# EAGLE design untitled (EAGLE 9.6.2)
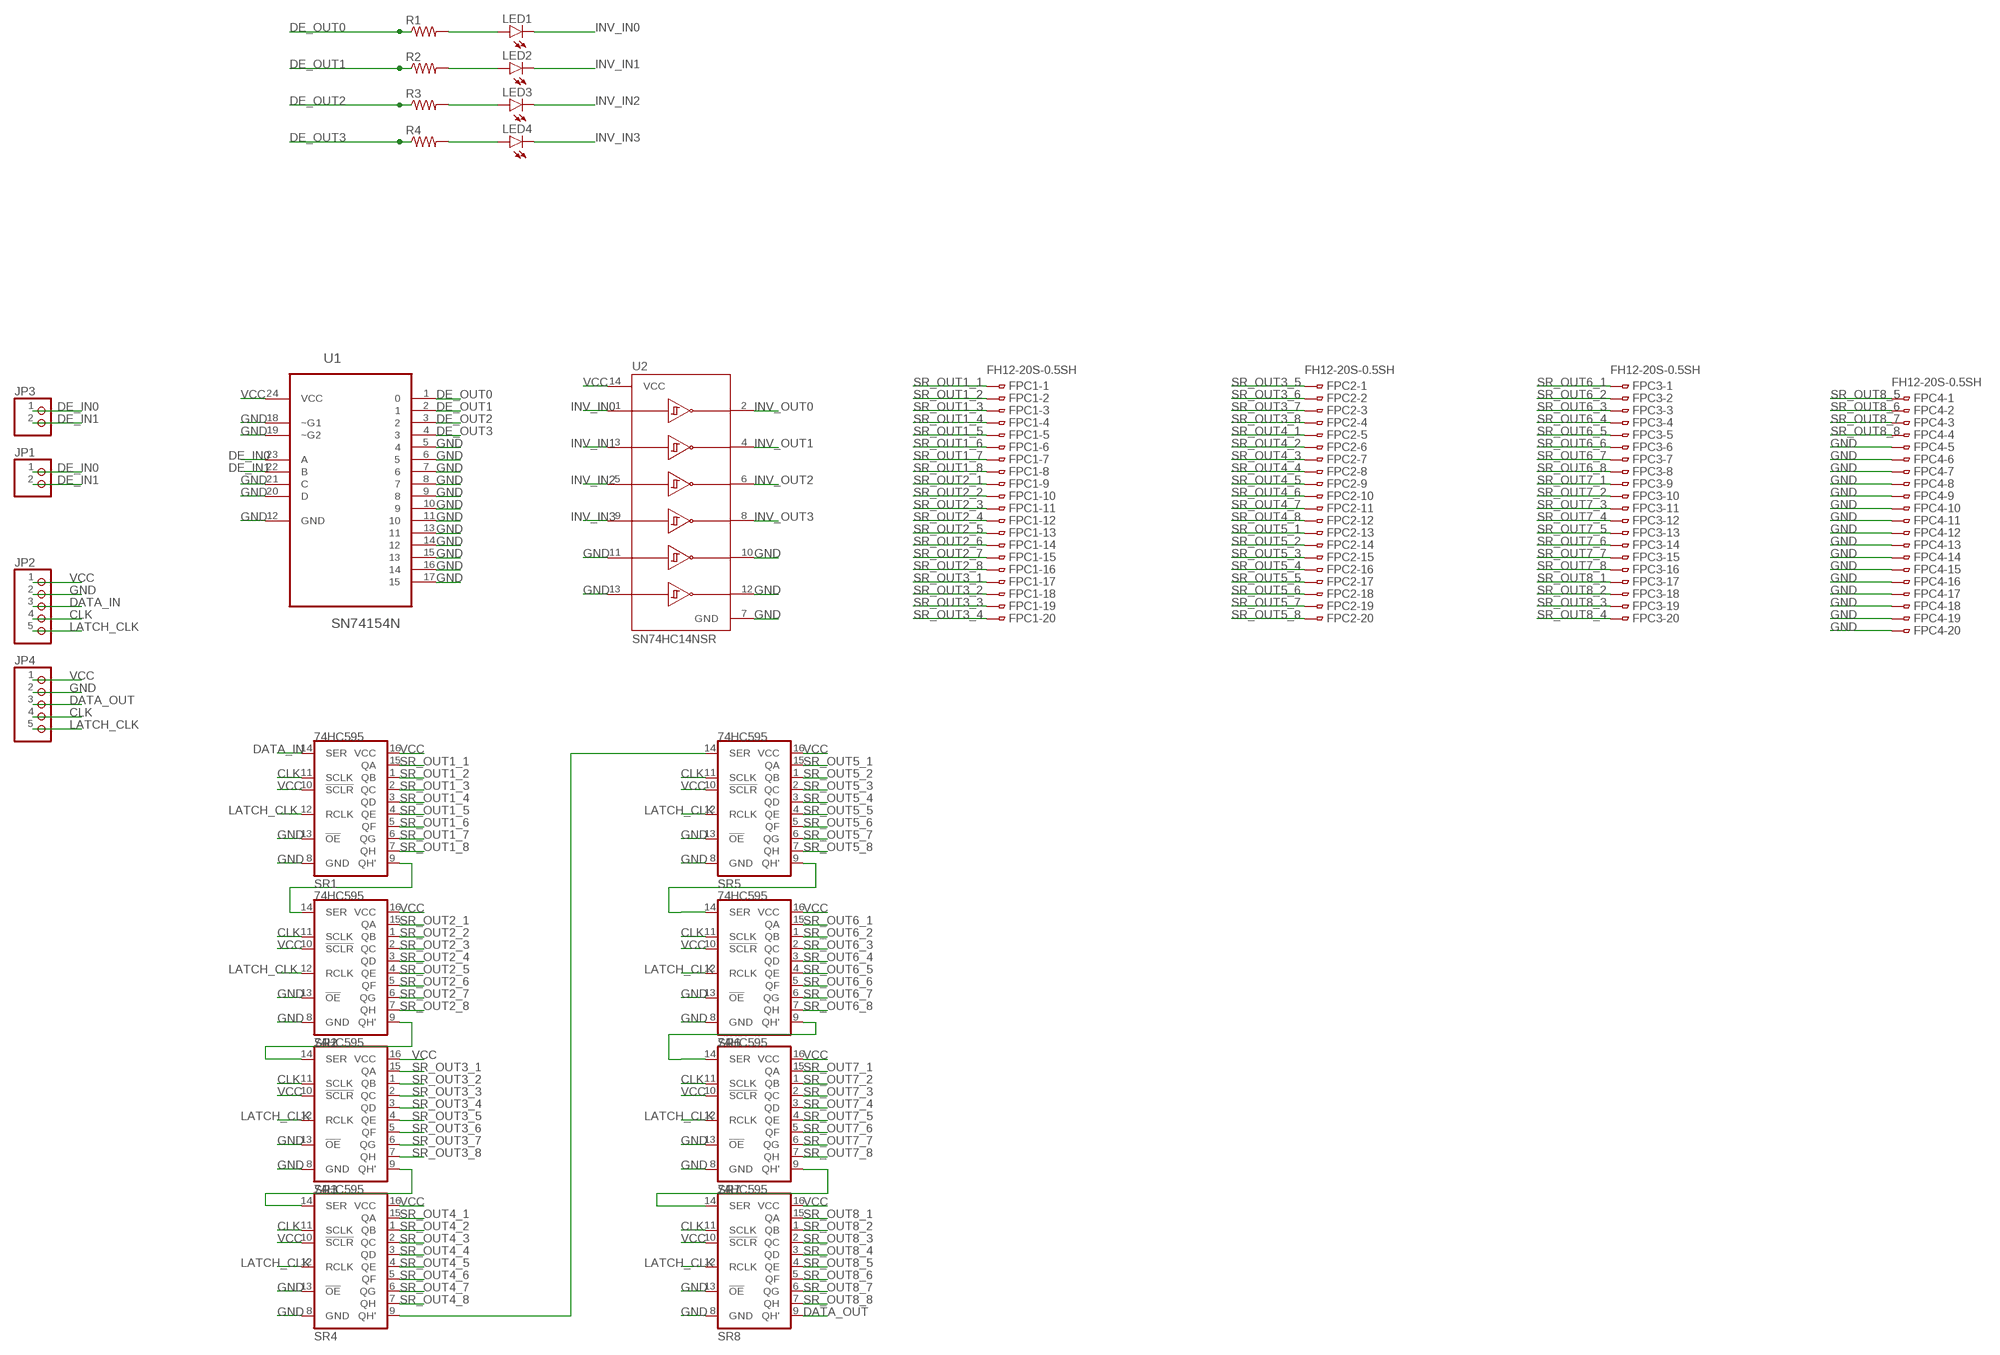
[diagram p0: schematic, sheet 1]

## Parts
FPC1  FH12-20S-0.5SH  [FH12-20S-0.5SH]
FPC2  FH12-20S-0.5SH  [FH12-20S-0.5SH]
FPC3  FH12-20S-0.5SH  [FH12-20S-0.5SH]
FPC4  FH12-20S-0.5SH  [FH12-20S-0.5SH]
JP1  PINHD-1X2  [1X02]
JP2  PINHD-1X5  [1X05]
JP3  PINHD-1X2  [1X02]
JP4  PINHD-1X5  [1X05]
LED1  LEDCHIPLED_0805  [CHIPLED_0805]
LED2  LEDCHIPLED_0805  [CHIPLED_0805]
LED3  LEDCHIPLED_0805  [CHIPLED_0805]
LED4  LEDCHIPLED_0805  [CHIPLED_0805]
R1  R-US_R0805  [R0805]
R2  R-US_R0805  [R0805]
R3  R-US_R0805  [R0805]
R4  R-US_R0805  [R0805]
SR1  74HC595  [SO16]
SR2  74HC595  [SO16]
SR3  74HC595  [SO16]
SR4  74HC595  [SO16]
SR5  74HC595  [SO16]
SR6  74HC595  [SO16]
SR7  74HC595  [SO16]
SR8  74HC595  [SO16]
U1  SN74154N  [DIP254P1080X508-24]
U2  SN74HC14NSR  [SOP127P780X200-14N]

## Nets
CLK: JP2.4 JP4.4 SR1.11(SCLK) SR2.11(SCLK) SR3.11(SCLK) SR4.11(SCLK) SR5.11(SCLK) SR6.11(SCLK) SR7.11(SCLK) SR8.11(SCLK)
DATA_IN: JP2.3 SR1.14(SER)
DATA_OUT: JP4.3 SR8.9(QH')
DE_IN0: JP1.1 JP3.1 U1.23(A)
DE_IN1: JP1.2 JP3.2 U1.22(B)
DE_OUT0: R1.1 U1.1
DE_OUT1: R2.1 U1.2
DE_OUT2: R3.1 U1.3
DE_OUT3: R4.1 U1.4
GND: FPC4.5 FPC4.6 FPC4.7 FPC4.8 FPC4.9 FPC4.10 FPC4.11 FPC4.12 FPC4.13 FPC4.14 FPC4.15 FPC4.16 FPC4.17 FPC4.18 FPC4.19 FPC4.20 JP2.2 JP4.2 SR1.8(GND) SR1.13(!OE) SR2.8(GND) SR2.13(!OE) SR3.8(GND) SR3.13(!OE) SR4.8(GND) SR4.13(!OE) SR5.8(GND) SR5.13(!OE) SR6.8(GND) SR6.13(!OE) SR7.8(GND) SR7.13(!OE) SR8.8(GND) SR8.13(!OE) U1.5 U1.6 U1.7 U1.8 U1.9 U1.10 U1.11 U1.12(GND) U1.13 U1.14 U1.15 U1.16 U1.17 U1.18(~G1) U1.19(~G2) U1.20(D) U1.21(C) U2.7(GND) U2.10(5Y) U2.11(5A) U2.12(6Y) U2.13(6A)
INV_IN0: LED1.C U2.1(1A)
INV_IN1: LED2.C U2.3(2A)
INV_IN2: LED3.C U2.5(3A)
INV_IN3: LED4.C U2.9(4A)
INV_OUT0: U2.2(1Y)
INV_OUT1: U2.4(2Y)
INV_OUT2: U2.6(3Y)
INV_OUT3: U2.8(4Y)
LATCH_CLK: JP2.5 JP4.5 SR1.12(RCLK) SR2.12(RCLK) SR3.12(RCLK) SR4.12(RCLK) SR5.12(RCLK) SR6.12(RCLK) SR7.12(RCLK) SR8.12(RCLK)
N$1: SR1.9(QH') SR2.14(SER)
N$2: LED1.A R1.2
N$3: LED2.A R2.2
N$4: LED3.A R3.2
N$5: LED4.A R4.2
N$8: SR2.9(QH') SR3.14(SER)
N$15: SR3.9(QH') SR4.14(SER)
N$22: SR7.9(QH') SR8.14(SER)
N$34: SR6.9(QH') SR7.14(SER)
N$36: SR4.9(QH') SR5.14(SER)
N$43: SR5.9(QH') SR6.14(SER)
SR_OUT1_1: FPC1.1 SR1.15(QA)
SR_OUT1_2: FPC1.2 SR1.1(QB)
SR_OUT1_3: FPC1.3 SR1.2(QC)
SR_OUT1_4: FPC1.4 SR1.3(QD)
SR_OUT1_5: FPC1.5 SR1.4(QE)
SR_OUT1_6: FPC1.6 SR1.5(QF)
SR_OUT1_7: FPC1.7 SR1.6(QG)
SR_OUT1_8: FPC1.8 SR1.7(QH)
SR_OUT2_1: FPC1.9 SR2.15(QA)
SR_OUT2_2: FPC1.10 SR2.1(QB)
SR_OUT2_3: FPC1.11 SR2.2(QC)
SR_OUT2_4: FPC1.12 SR2.3(QD)
SR_OUT2_5: FPC1.13 SR2.4(QE)
SR_OUT2_6: FPC1.14 SR2.5(QF)
SR_OUT2_7: FPC1.15 SR2.6(QG)
SR_OUT2_8: FPC1.16 SR2.7(QH)
SR_OUT3_1: FPC1.17 SR3.15(QA)
SR_OUT3_2: FPC1.18 SR3.1(QB)
SR_OUT3_3: FPC1.19 SR3.2(QC)
SR_OUT3_4: FPC1.20 SR3.3(QD)
SR_OUT3_5: FPC2.1 SR3.4(QE)
SR_OUT3_6: FPC2.2 SR3.5(QF)
SR_OUT3_7: FPC2.3 SR3.6(QG)
SR_OUT3_8: FPC2.4 SR3.7(QH)
SR_OUT4_1: FPC2.5 SR4.15(QA)
SR_OUT4_2: FPC2.6 SR4.1(QB)
SR_OUT4_3: FPC2.7 SR4.2(QC)
SR_OUT4_4: FPC2.8 SR4.3(QD)
SR_OUT4_5: FPC2.9 SR4.4(QE)
SR_OUT4_6: FPC2.10 SR4.5(QF)
SR_OUT4_7: FPC2.11 SR4.6(QG)
SR_OUT4_8: FPC2.12 SR4.7(QH)
SR_OUT5_1: FPC2.13 SR5.15(QA)
SR_OUT5_2: FPC2.14 SR5.1(QB)
SR_OUT5_3: FPC2.15 SR5.2(QC)
SR_OUT5_4: FPC2.16 SR5.3(QD)
SR_OUT5_5: FPC2.17 SR5.4(QE)
SR_OUT5_6: FPC2.18 SR5.5(QF)
SR_OUT5_7: FPC2.19 SR5.6(QG)
SR_OUT5_8: FPC2.20 SR5.7(QH)
SR_OUT6_1: FPC3.1 SR6.15(QA)
SR_OUT6_2: FPC3.2 SR6.1(QB)
SR_OUT6_3: FPC3.3 SR6.2(QC)
SR_OUT6_4: FPC3.4 SR6.3(QD)
SR_OUT6_5: FPC3.5 SR6.4(QE)
SR_OUT6_6: FPC3.6 SR6.5(QF)
SR_OUT6_7: FPC3.7 SR6.6(QG)
SR_OUT6_8: FPC3.8 SR6.7(QH)
SR_OUT7_1: FPC3.9 SR7.15(QA)
SR_OUT7_2: FPC3.10 SR7.1(QB)
SR_OUT7_3: FPC3.11 SR7.2(QC)
SR_OUT7_4: FPC3.12 SR7.3(QD)
SR_OUT7_5: FPC3.13 SR7.4(QE)
SR_OUT7_6: FPC3.14 SR7.5(QF)
SR_OUT7_7: FPC3.15 SR7.6(QG)
SR_OUT7_8: FPC3.16 SR7.7(QH)
SR_OUT8_1: FPC3.17 SR8.15(QA)
SR_OUT8_2: FPC3.18 SR8.1(QB)
SR_OUT8_3: FPC3.19 SR8.2(QC)
SR_OUT8_4: FPC3.20 SR8.3(QD)
SR_OUT8_5: FPC4.1 SR8.4(QE)
SR_OUT8_6: FPC4.2 SR8.5(QF)
SR_OUT8_7: FPC4.3 SR8.6(QG)
SR_OUT8_8: FPC4.4 SR8.7(QH)
VCC: JP2.1 JP4.1 SR1.10(!SCLR) SR1.16(VCC) SR2.10(!SCLR) SR2.16(VCC) SR3.10(!SCLR) SR3.16(VCC) SR4.10(!SCLR) SR4.16(VCC) SR5.10(!SCLR) SR5.16(VCC) SR6.10(!SCLR) SR6.16(VCC) SR7.10(!SCLR) SR7.16(VCC) SR8.10(!SCLR) SR8.16(VCC) U1.24(VCC) U2.14(VCC)

## Library data of the parts
FPC1-FPC4 = con-hirose:FH12-20S-0.5S: 0.5mm Pitch Connectors For FPC/FFC Source: Data sheet <http://www.hirose.co.jp/cataloge_hp/e58605370.pdf>; MPN: FH12-20S-0.5SH(55); OC_FARNELL: 1324549; OC_NEWARK: 34M6166
JP1 JP3 = pinhead:PINHD-1X2: PIN HEADER
JP2 JP4 = pinhead:PINHD-1X5: PIN HEADER
LED1-LED4 = led:LED: LED OSRAM: - CHIPLED LG R971, LG N971, LY N971, LG Q971, LY Q971, LO R971, LY R971 LH N974, LH R974 LS Q976, LO Q976, LY Q976 LO Q996 - Hyper CHIPLED LW Q18S LB Q993, LB Q99A, LB R99A - SideLED LS A670, LO A670, LY A670, LG A670, LP A670 LB A673, LV A673, LT A673, LW A673 LH A674 LY A675 LS A676, LA A676, LO A676, LY A676, LW A676 LS A679, LY A679, LG A679 - Hyper Micro SIDELED® LS Y876, LA Y876, LO Y876, LY Y876 LT Y87S - SmartLED LW L88C, LW L88S LB L89C, LB L89S, LG L890 LS L89K, LO L89K, LY L89K LS L896, LA L896, LO L896, LY L896 - TOPLED LS T670, LO T670, LY T670, LG T670, LP T670 LSG T670, LSP T670, LSY T670, LOP T670, LYG T670 LG T671, LOG T671, LSG T671 LB T673, LV T673, LT T673, LW T673 LH T674 LS T676, LA T676, LO T676, LY T676, LB T676, LH T676, LSB T676, LW T676 LB T67C, LV T67C, LT T67C, LS T67K, LO T67K, LY T67K, LW E67C LS E67B, LA E67B, LO E67B, LY E67B, LB E67C, LV E67C, LT E67C LW T67C LS T679, LY T679, LG T679 LS T770, LO T770, LY T770, LG T770, LP T770 LB T773, LV T773, LT T773, LW T773 LH T774 LS E675, LA E675, LY E675, LS T675 LS T776, LA T776, LO T776, LY T776, LB T776 LHGB T686 LT T68C, LB T68C - Hyper Mini TOPLED® LB M676 - Mini TOPLED Santana® LG M470 LS M47K, LO M47K, LY M47K Source: http://www.osram.convergy.de LUXEON: - LUMILED® LXK2-PW12-R00, LXK2-PW12-S00, LXK2-PW14-U00, LXK2-PW14-V00 LXK2-PM12-R00, LXK2-PM12-S00, LXK2-PM14-U00 LXK2-PE12-Q00, LXK2-PE12-R00, LXK2-PE12-S00, LXK2-PE14-T00, LXK2-PE14-U00 LXK2-PB12-K00, LXK2-PB12-L00, LXK2-PB12-M00, LXK2-PB14-N00, LXK2-PB14-P00, LXK2-PB14-Q00 LXK2-PR12-L00, LXK2-PR12-M00, LXK2-PR14-Q00, LXK2-PR14-R00 LXK2-PD12-Q00, LXK2-PD12-R00, LXK2-PD12-S00 LXK2-PH12-R00, LXK2-PH12-S00 LXK2-PL12-P00, LXK2-PL12-Q00, LXK2-PL12-R00 Source: www.luxeon.com KINGBRIGHT: KA-3528ASYC Source: www.kingbright.com
R1-R4 = rcl:R-US_: RESISTOR, American symbol; SPICEPREFIX: R
SR1-SR8 = 74HC595:74HC595: 8-bit SHIFT REGISTER, output latch Check availability <https://pricing.snapeda.com/parts/74HC595/Nexperia/view-part?ref=eda>; AVAILABILITY: In Stock; DESCRIPTION: Shift Register Single 8-Bit Serial to Serial/Parallel 16-Pin SSOP T/R; MF: Nexperia; MP: 74HC595; PACKAGE: None; PRICE: None
U1 = SN74154N:SN74154N: DECODERS/DEMULTIPLEXERS Check availability <https://pricing.snapeda.com/parts/SN74154N/Texas%20Instruments/view-part?ref=eda>; AVAILABILITY: In Stock; DESCRIPTION: Decoder/Demultiplexer 1 x 4:16 24-PDIP; MF: Texas Instruments; MP: SN74154N; PACKAGE: DIP-24 Texas Instruments; PRICE: None; PURCHASE-URL: https://pricing.snapeda.com/search?q=SN74154N&ref=eda
U2 = SN74HC14NSR:SN74HC14NSR: Check availability <https://pricing.snapeda.com/parts/SN74HC14NSR/Texas%20Instruments/view-part?ref=eda>; AVAILABILITY: In Stock; DESCRIPTION: 6-ch, 2-V to 6-V inverters with Schmitt-Trigger inputs; MF: Texas Instruments; MP: SN74HC14NSR; PACKAGE: SOP-14 Texas Instruments; PRICE: None; PURCHASE-URL: https://pricing.snapeda.com/search?q=SN74HC14NSR&ref=eda

## Board
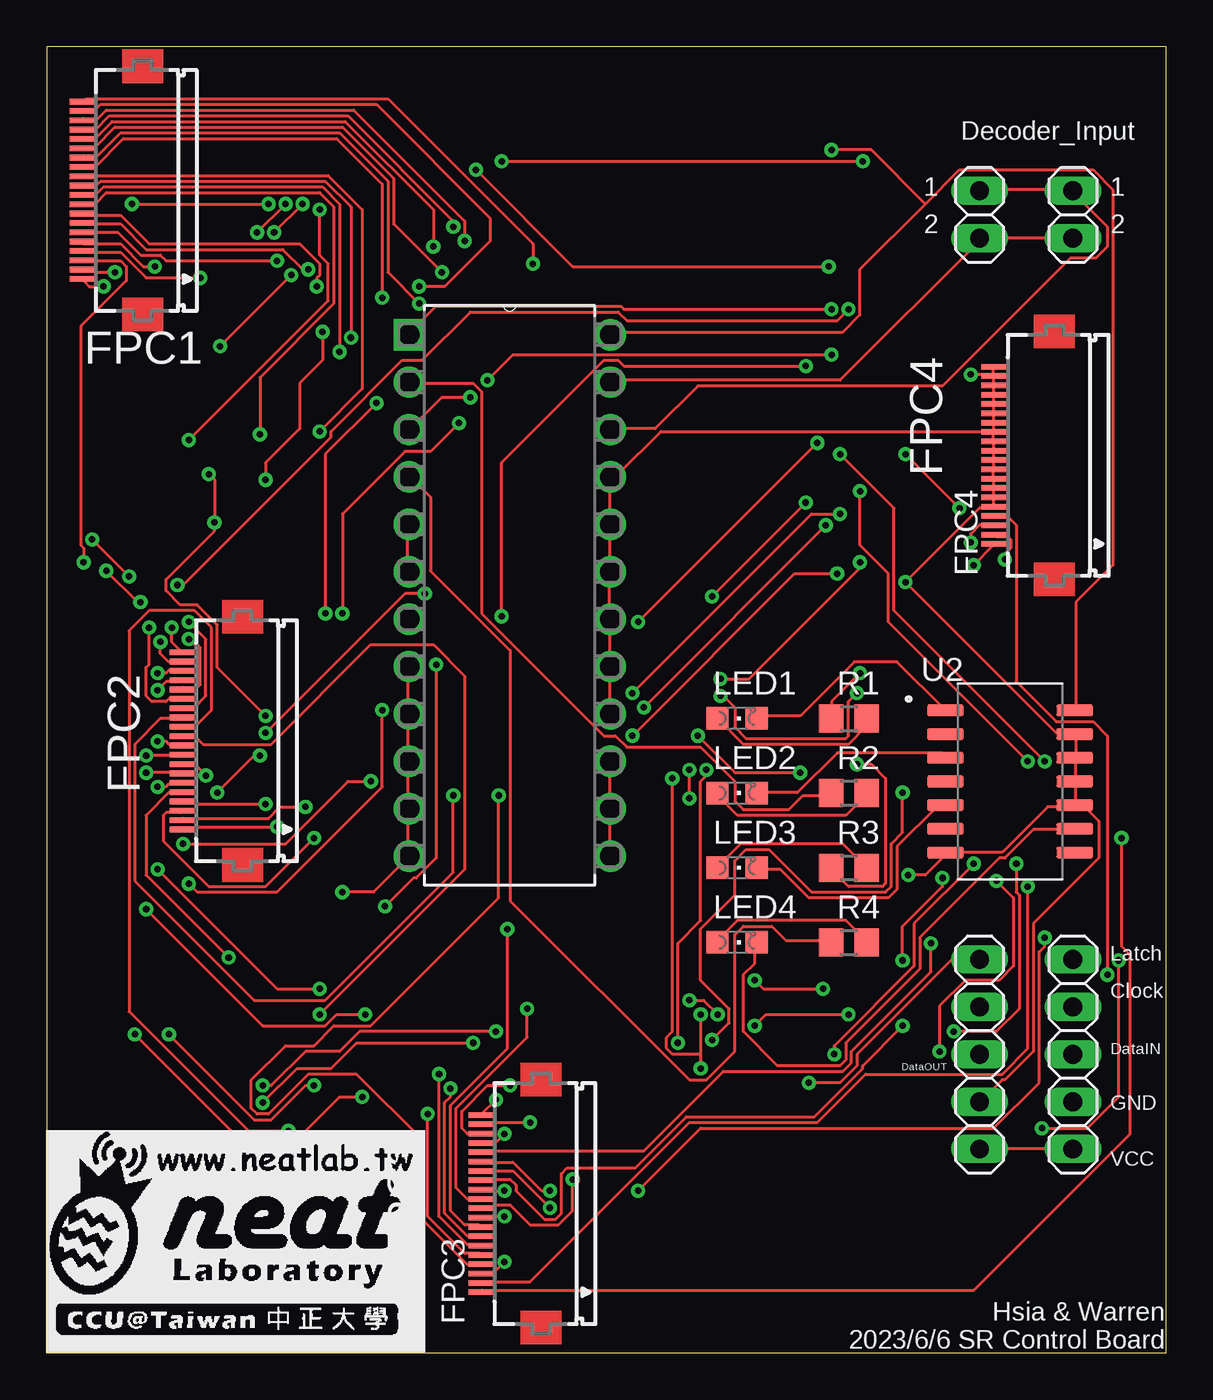
[diagram p1: board, top side]
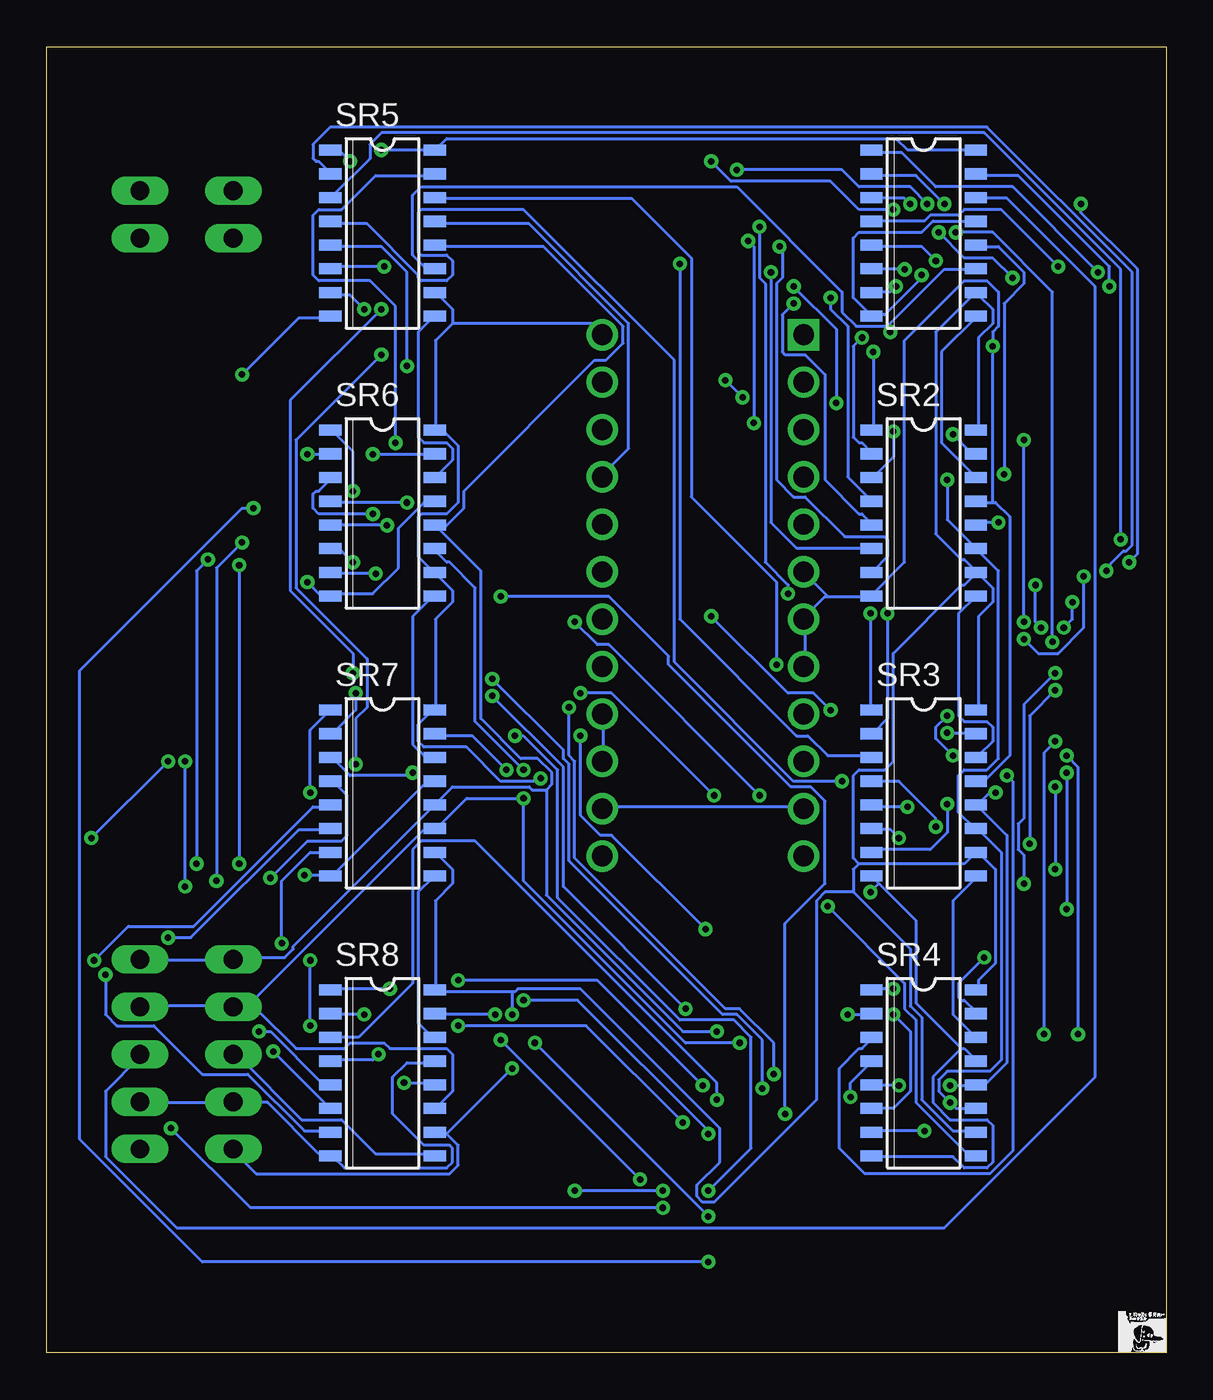
[diagram p2: board, bottom side, seen from below]

Size 60 x 70 mm. Coordinates in mm from the lower left corner, seen from the top.
Outline: 0,0 60,0 60,70 0,70 0,0
Copper layers (1*16): Top 0.035mm / dielectric 1.5mm / Bottom 0.035mm
Design rules "default": minimum track width 6mil, minimum drill 0.35mm, track to track 6mil, track to pad 6mil, pad to pad 6mil, via to via 6mil, smd to smd 6mil, copper to edge 40mil, drill to drill 6mil, minimum pad ring 10mil, minimum via ring 8mil, stop-mask expansion 4mil, vias tented up to drill 0mil, thermal gap 10mil

### Footprints (pad centres in the part's own frame; a part is rotated, then mirrored left to right if it is on the bottom)
FH12-20S-0.5SH = smd 0.3 x 1.3: 1 -4.75,3.25; 2 -4.25,3.25; 3 -3.75,3.25; 4 -3.25,3.25; 5 -2.75,3.25; 6 -2.25,3.25; 7 -1.75,3.25; 8 -1.25,3.25; 9 -0.75,3.25; 10 -0.25,3.25; 11 0.25,3.25; 12 0.75,3.25; 13 1.25,3.25; 14 1.75,3.25; 15 2.25,3.25; 16 2.75,3.25; 17 3.25,3.25; 18 3.75,3.25; 19 4.25,3.25; 20 4.75,3.25
1X02 = drill 1.016 long: 1 -1.27,0; 2 1.27,0
1X05 = drill 1.016 long: 1 -5.08,0; 2 -2.54,0; 3 0,0; 4 2.54,0; 5 5.08,0
CHIPLED_0805 = smd 1.2 x 1.2: A 0,-1.05; C 0,1.05
R0805 = smd 1.3 x 1.5: 1 -0.95,0; 2 0.95,0
SO16 = smd 0.6 x 1.2: 1 -4.445,-2.8; 2 -3.175,-2.8; 3 -1.905,-2.8; 4 -0.635,-2.8; 5 0.635,-2.8; 6 1.905,-2.8; 7 3.175,-2.8; 8 4.445,-2.8; 9 4.445,2.8; 10 3.175,2.8; 11 1.905,2.8; 12 0.635,2.8; 13 -0.635,2.8; 14 -1.905,2.8; 15 -3.175,2.8; 16 -4.445,2.8
DIP254P1080X508-24 = drill 1.118 square: 1 -10.795,27.94 | drill 1.118: 2 -10.795,25.4; 3 -10.795,22.86; 4 -10.795,20.32; 5 -10.795,17.78; 6 -10.795,15.24; 7 -10.795,12.7; 8 -10.795,10.16; 9 -10.795,7.62; 10 -10.795,5.08; 11 -10.795,2.54; 12 -10.795,0; 13 0,0; 14 0,2.54; 15 0,5.08; 16 0,7.62; 17 0,10.16; 18 0,12.7; 19 0,15.24; 20 0,17.78; 21 0,20.32; 22 0,22.86; 23 0,25.4; 24 0,27.94
SOP127P780X200-14N = smd 1.97 x 0.61: 1 -3.465,3.81; 2 -3.465,2.54; 3 -3.465,1.27; 4 -3.465,0; 5 -3.465,-1.27; 6 -3.465,-2.54; 7 -3.465,-3.81; 8 3.465,-3.81; 9 3.465,-2.54; 10 3.465,-1.27; 11 3.465,0; 12 3.465,1.27; 13 3.465,2.54; 14 3.465,3.81

### Placement (x,y rotation side)
FPC1  5.14,62.3 90 top
FPC2  10.5,32.8 90 top
FPC3  26.5,8 90 top
FPC4  54,48.1 90 top
JP1  55,61 90 top
JP2  55,16 90 top
JP3  50,61 90 top
JP4  50,16 90 top
LED1  37,34 270 top
LED2  37,30 270 top
LED3  37,26 270 top
LED4  37,22 270 top
LOGO  [LOGO_SCALE_2.0]  0,0 0 top
R1  43,34 0 top
R2  43,30 0 top
R3  43,26 0 top
R4  43,22 0 top
SR1  13,60 270 bottom
SR2  13,45 270 bottom
SR3  13,30 270 bottom
SR4  13,15 270 bottom
SR5  42,60 270 bottom
SR6  42,45 270 bottom
SR7  42,30 270 bottom
SR8  42,15 270 bottom
U1  30.22,26.62 0 top
U2  51.63,30.62 0 top

### Tracks (layer width: path | path; a pad name or v marks a point on that pad's centre or on a via)
CLK  (via drill 0.35)
  Top 0.152: v34.44,29.72 v34.44,31.24 | v11.73,46.79 11.73,47.7 13.56,49.53 13.56,51.97 14.78,53.19 v14.78,54.71 | v22.86,16.61 16.61,16.61 15.24,15.24 13.41,15.24 v11.58,13.41
  Bottom 0.152: 48.77,18.44 46.63,16.31 44.04,16.31 43.74,16.61 41.91,16.61 41.6,16.31 38.56,16.31 38.25,16 38.25,14.02 39.17,13.11 SR8.11 | 48.77,18.44 49.99,18.44 JP4.4 | 48.77,18.44 48.77,19.05 39.78,28.04 39.32,28.04 SR7.11 39.17,28.04 37.49,29.72 v34.44,29.72 34.44,25.3 25.76,16.61 v22.86,16.61 | 48.77,18.44 JP4.4 | v34.44,31.24 37.03,33.83 37.03,41 38.41,42.37 38.56,42.37 39.17,42.98 SR6.11 | JP2.4 54.86,18.59 50.14,18.59 JP4.4 | SR4.11 10.21,13.11 11.28,13.11 v11.58,13.41 12.19,14.02 12.19,14.63 11.73,15.09 9.45,15.09 8.84,15.7 8.84,26.82 10.06,28.04 SR3.11 10.21,28.04 11.12,28.96 11.12,30.94 10.82,31.24 9.6,31.24 8.99,31.85 8.99,41.91 10.06,42.98 SR2.11 10.21,43.13 11.73,44.65 v11.73,46.79 | 15.09,55.02 16.61,55.02 17.37,55.78 17.37,56.84 23.01,62.48 39.93,62.48 40.39,62.03 40.39,58.83 39.78,58.22 39.32,58.22 SR5.11 | 15.09,55.02 14.94,55.02 11.89,58.06 10.21,58.06 SR1.11 | 15.09,55.02 v14.78,54.71
DATA_IN
  Bottom 0.152: SR1.14 10.06,61.87 8.53,61.87 3.81,57.15 3.81,14.78 11.89,6.71 53.03,6.71 56.84,10.52 56.84,14.02 55.02,15.85 JP2.3
DATA_OUT
  Bottom 0.152: SR8.9 39.32,10.67 42.37,10.67 44.2,12.5 46.33,12.5 49.68,15.85 49.99,15.85 JP4.3
DE_IN0
  Top 0.152: JP1.1 54.86,59.74 50.14,59.74 JP3.1 49.99,59.59 42.52,52.12 30.33,52.12 U1.23
DE_IN1
  Top 0.152: JP3.2 50.14,62.33 54.86,62.33 JP1.2 55.02,62.18 56.84,60.35 56.84,59.28 56.24,58.67 54.86,58.67 48.01,51.82 34.9,51.82 32.61,49.53 30.33,49.53 U1.22
DE_OUT0  (via drill 0.35)
  Top 0.152: v43.59,36.42 42.06,34.9 42.06,34.14 R1.1 | v42.06,55.93 30.94,55.93 30.79,56.08 20.88,56.08 19.51,54.71 U1.1
  Bottom 0.152: v43.59,36.42 43.59,37.49 46.94,40.84 46.94,51.05 v42.06,55.93
DE_OUT1
  Top 0.152: R2.1 41.91,29.87 40.54,29.87 39.78,29.11 37.34,29.11 36.88,29.57 36.88,30.63 35.05,32.46 31.09,32.46 30.48,33.07 29.87,33.07 23.32,39.62 23.32,51.51 22.86,51.97 19.51,51.97 U1.2
DE_OUT2  (via drill 0.35)
  Top 0.152: v43.43,31.55 44.2,31.55 44.96,30.79 44.96,25.15 44.81,24.99 42.98,24.99 42.06,25.91 R3.1 | v42.06,53.49 24.99,53.49 v23.62,52.12 | v22.71,51.21 21.18,51.21 19.51,49.53 U1.3
  Bottom 0.152: v43.43,31.55 43.43,33.98 42.82,34.59 42.82,37.19 46.63,41 46.63,48.92 v42.06,53.49 | v22.71,51.21 v23.62,52.12
DE_OUT3
  Top 0.152: R4.1 41.91,22.1 39.62,22.1 38.86,22.86 37.34,22.86 36.88,22.4 36.88,16.15 35.36,14.63 34.44,14.63 24.84,24.23 24.84,37.64 20.57,41.91 20.57,45.87 19.51,46.94 U1.4
GND  (via drill 0.35)
  Top 0.152: 50.75,49.38 50.75,49.84 FPC4.14 50.75,49.99 50.75,50.29 FPC4.15 50.75,50.44 50.75,50.75 FPC4.16 50.75,50.9 50.75,51.21 FPC4.17 50.75,51.82 FPC4.18 50.75,51.97 50.75,52.27 FPC4.19 50.75,52.43 | 50.75,52.43 v49.53,52.43 | 50.75,52.43 50.75,52.73 FPC4.20 | U2.10 55.02,29.26 53.65,29.26 51.21,26.82 48.31,26.82 U2.7 48.16,26.67 47.09,25.6 v46.18,25.6 | U2.10 55.17,29.41 55.17,30.48 U2.11 55.17,30.63 55.17,31.85 U2.12 55.17,32 55.17,33.07 U2.13 55.02,33.22 54.1,33.22 v46.02,41.3 49.99,45.26 50.75,45.26 FPC4.5 50.75,45.41 50.75,45.72 FPC4.6 50.75,45.87 50.75,46.33 FPC4.7 50.75,46.48 50.75,46.79 FPC4.8 50.75,46.94 50.75,47.24 FPC4.9 50.75,47.4 50.75,47.7 FPC4.10 50.75,48.31 FPC4.11 50.75,48.46 50.75,48.77 FPC4.12 50.75,48.92 50.75,49.23 FPC4.13 50.75,49.38 | JP4.2 50.14,13.56 51.21,14.63 51.36,14.63 52.88,16.15 52.88,23.01 56.39,26.52 56.39,28.5 55.63,29.26 55.17,29.26 U2.10 | U1.13 30.18,26.67 30.18,29.11 U1.14 30.18,29.26 30.18,31.7 U1.15 | U1.16 30.18,34.29 30.18,36.73 U1.17 30.18,36.88 30.18,39.32 U1.18 30.18,39.47 30.18,41.76 U1.19 30.18,41.91 30.18,44.35 U1.20 30.18,44.5 30.18,46.94 U1.21 30.33,47.09 30.63,47.09 32.92,49.38 50.75,49.38 | v9.3,53.95 v13.11,57.76 | U1.5 19.36,44.35 19.36,41.91 U1.6 | U1.8 19.36,36.73 19.36,34.29 U1.9 19.36,34.14 19.36,31.85 U1.10 19.36,31.7 19.36,29.26 U1.11 19.36,29.11 19.36,26.67 U1.12 19.36,26.52 17.53,24.69 v15.85,24.69
  Bottom 0.152: SR6.13 39.32,45.57 39.78,45.57 41.15,44.2 41.15,42.06 42.52,40.69 44.65,40.69 SR6.8 44.81,40.69 45.41,40.69 v46.02,41.3 | v49.53,52.43 46.48,55.47 44.81,55.47 SR5.8 | JP2.2 54.86,13.41 50.14,13.41 JP4.2 49.99,13.41 48.16,13.41 45.41,10.67 44.81,10.67 SR8.8 44.65,10.52 44.04,9.91 38.56,9.91 38.25,10.21 38.25,10.97 38.41,11.12 39.78,11.12 41.45,12.8 41.45,14.78 40.69,15.54 39.32,15.54 SR8.13 | SR7.13 39.32,30.63 39.62,30.63 44.65,25.6 SR7.8 44.81,25.6 v46.18,25.6 | U1.15 30.18,31.85 30.18,34.14 U1.16 | SR5.13 39.17,60.5 34.14,60.5 28.8,55.17 28.8,48.46 30.18,47.09 U1.21 | SR1.13 10.21,60.66 12.5,60.66 13.11,60.05 16.46,60.05 16.76,59.74 16.76,56.54 15.85,55.63 SR1.8 15.7,55.63 15.09,55.63 13.11,57.61 v13.11,57.76 | 9.3,45.57 10.06,45.57 SR2.13 | 9.3,45.57 9.14,45.57 8.38,44.81 8.38,32 9.6,30.79 10.06,30.79 SR3.13 | 9.3,45.57 v9.3,53.95 9.3,54.71 8.99,55.02 8.99,56.84 9.6,57.45 10.82,57.45 14.02,54.25 14.02,42.37 15.7,40.69 SR2.8 15.85,40.54 18.14,40.54 | 10.97,16.31 10.82,16.31 10.21,15.7 SR4.13 | 10.97,16.31 13.41,18.75 13.41,23.16 15.39,25.15 | 15.39,25.15 15.7,25.45 SR3.8 | 10.97,16.31 12.5,14.78 12.5,13.41 11.58,12.5 9.6,12.5 9.3,12.19 9.3,10.21 9.6,9.91 10.82,9.91 11.43,10.52 15.7,10.52 SR4.8 | 18.14,40.54 18.29,40.54 19.36,39.47 U1.7 19.36,39.32 19.36,36.88 U1.8 | 18.14,40.54 19.36,41.76 U1.6 | v15.85,24.69 15.39,25.15 | U1.14 30.18,29.26 19.51,29.26 U1.11
INV_IN0
  Top 0.152: LED1.C 38.1,34.14 40.39,34.14 43.28,37.03 45.57,37.03 48.16,34.44 U2.1
INV_IN1
  Top 0.152: LED2.C 38.1,30.02 40.23,30.02 42.37,32.16 48.01,32.16 48.16,32 U2.3
INV_IN2
  Top 0.152: LED3.C 38.1,25.91 39.32,25.91 40.84,24.38 45.11,24.38 45.57,24.84 45.57,27.13 47.7,29.26 48.16,29.26 U2.5
INV_IN3
  Top 0.152: LED4.C 37.95,21.95 37.95,20.88 37.34,20.27 37.34,17.22 39.17,15.39 42.52,15.39 42.82,15.7 42.82,16.61 46.79,20.57 46.79,22.25 51.05,26.52 51.36,26.52 52.88,28.04 55.02,28.04 U2.9
LATCH_CLK  (via drill 0.35)
  Top 0.152: v8.69,47.09 8.99,46.79 v8.99,44.5 8.99,44.04 6.4,41.45 6.4,40.84 7.16,40.08 8.08,40.08 9.14,39.01 9.14,36.73 v11.73,34.14 | v40.84,14.48 42.52,14.48 43.43,15.39 43.43,16 48.46,21.03 49.99,21.03 JP4.5 | v11.58,14.33 12.04,14.33 13.87,16.15 15.7,16.15 16.76,17.22 v24.08,17.22 | v11.43,32 11.12,32 v9.14,30.02
  Bottom 0.152: v8.99,44.5 10.06,44.5 SR2.12 | v8.69,47.09 8.69,56.24 7.62,57.3 7.62,57.91 8.99,59.28 10.06,59.28 SR1.12 | v40.84,14.48 39.32,14.48 SR8.12 | 38.86,44.04 36.73,41.91 36.73,33.98 34.59,31.85 33.68,31.85 32.92,31.09 32.92,30.48 33.22,30.18 | 38.86,44.04 39.17,44.35 SR6.12 | 33.22,30.18 33.98,30.18 34.14,30.33 38.25,30.33 39.17,29.41 SR7.12 39.32,29.26 46.79,21.79 46.79,21.64 47.24,21.18 49.99,21.18 JP4.5 50.14,21.03 54.86,21.03 JP2.5 | 38.86,44.04 37.64,45.26 37.64,46.18 30.63,53.19 30.02,53.19 29.11,54.1 29.11,55.02 33.38,59.28 39.17,59.28 SR5.12 | v11.58,14.33 10.21,14.33 SR4.12 10.06,14.48 9.6,14.48 8.53,15.54 8.53,27.74 10.06,29.26 SR3.12 10.06,29.41 9.45,30.02 v9.14,30.02 | v24.08,17.22 25.91,17.22 33.22,24.54 33.22,30.18 | v11.73,34.14 12.34,33.53 12.34,32.92 v11.43,32
N$1
  Bottom 0.152: SR2.14 10.21,46.94 12.04,48.77 12.04,53.65 10.21,55.47 SR1.9
N$2
  Top 0.152: LED1.A 35.97,33.98 37.34,32.61 42.98,32.61 43.89,33.53 43.89,33.98 R1.2
N$3
  Top 0.152: LED2.A 35.97,29.87 37.03,28.8 42.82,28.8 43.89,29.87 R2.2
N$4
  Top 0.152: LED3.A 35.97,26.06 37.19,27.28 42.67,27.28 43.89,26.06 R3.2
N$5
  Top 0.152: LED4.A 35.97,22.1 37.03,23.16 42.82,23.16 43.89,22.1 R4.2
N$8
  Bottom 0.152: SR3.14 10.06,32 9.3,32.77 9.3,33.53 9.6,33.83 10.82,33.83 11.12,34.14 11.12,39.62 10.21,40.54 SR2.9
N$15
  Bottom 0.152: SR4.14 10.21,16.92 11.43,18.14 11.43,24.23 10.21,25.45 SR3.9
N$22
  Bottom 0.152: SR8.14 39.32,16.92 40.08,17.68 40.08,24.69 39.32,25.45 SR7.9
N$34
  Bottom 0.152: SR7.14 39.32,32 39.78,32 40.39,32.61 40.39,39.47 39.32,40.54 SR6.9
N$36  (via drill 0.35)
  Top 0.152: v18.14,23.93 19.66,25.45 19.81,25.45 20.88,26.52 v20.88,36.88
  Bottom 0.152: v18.14,23.93 14.02,19.81 14.02,18.44 13.41,17.83 13.41,13.41 10.67,10.67 10.21,10.67 SR4.9 | v20.88,36.88 20.88,41.3 25.45,45.87 25.45,58.67 28.65,61.87 39.17,61.87 SR5.14
N$43
  Bottom 0.152: SR6.14 39.17,46.94 38.25,47.85 38.25,48.46 38.56,48.77 39.78,48.77 40.08,49.07 40.08,54.71 39.32,55.47 SR5.9
SR_OUT1_1  (via drill 0.35)
  Top 0.152: v3.05,57.15 2.29,57.15 1.98,57.45 FPC1.1
  Bottom 0.152: v3.05,57.15 3.05,58.22 7.92,63.09 10.06,63.09 SR1.15
SR_OUT1_2  (via drill 0.35)
  Top 0.152: v3.66,57.91 2.74,57.91 2.59,58.06 1.98,58.06 FPC1.2
  Bottom 0.152: v3.66,57.91 8.23,62.48 12.34,62.48 14.17,64.31 15.7,64.31 SR1.1
SR_OUT1_3  (via drill 0.35)
  Top 0.152: v4.57,61.57 v11.89,61.57 | v1.98,42.37 1.98,43.13 1.83,43.28 1.83,55.02 4.27,57.45 4.27,58.22 3.96,58.52 1.98,58.52 FPC1.3
  Bottom 0.152: v11.89,61.57 13.41,63.09 15.7,63.09 SR1.2 | v4.57,61.57 4.57,61.11 1.52,58.06 1.52,42.82 v1.98,42.37
SR_OUT1_4  (via drill 0.35)
  Top 0.152: v12.19,60.05 v13.72,61.57 | v8.23,57.61 5.33,57.61 3.96,58.98 1.98,58.98 FPC1.4
  Bottom 0.152: v13.72,61.57 14.02,61.87 15.7,61.87 SR1.3 | v12.19,60.05 10.82,58.67 9.3,58.67 v8.23,57.61
SR_OUT1_5  (via drill 0.35)
  Top 0.152: v5.79,58.22 5.18,58.22 3.96,59.44 1.98,59.44 FPC1.5
  Bottom 0.152: v5.79,58.22 8.84,61.27 10.82,61.27 11.12,60.96 12.65,60.96 12.95,60.66 15.7,60.66 SR1.4
SR_OUT1_6  (via drill 0.35)
  Top 0.152: v12.34,58.52 6.4,58.52 6.1,58.83 5.03,58.83 3.81,60.05 1.98,60.05 FPC1.6
  Bottom 0.152: v12.34,58.52 13.11,59.28 15.7,59.28 SR1.5
SR_OUT1_7  (via drill 0.35)
  Top 0.152: v14.02,58.06 13.72,58.06 12.65,59.13 5.33,59.13 3.96,60.5 1.98,60.5 FPC1.7
  Bottom 0.152: v14.02,58.06 15.7,58.06 SR1.6
SR_OUT1_8  (via drill 0.35)
  Top 0.152: v14.48,57.15 14.48,57.61 14.63,57.76 14.63,58.37 13.56,59.44 5.49,59.44 3.96,60.96 1.98,60.96 FPC1.8
  Bottom 0.152: v14.48,57.15 14.78,56.84 15.7,56.84 SR1.7
SR_OUT2_1  (via drill 0.35)
  Top 0.152: v11.43,49.23 11.43,52.27 15.39,56.24 15.39,61.42 14.63,62.18 3.2,62.18 2.59,61.57 1.98,61.57 FPC1.9
  Bottom 0.152: v11.43,49.23 10.52,48.31 10.21,48.31 SR2.15
SR_OUT2_2  (via drill 0.35)
  Top 0.152: v15.7,53.65 15.7,61.57 14.78,62.48 3.05,62.48 2.59,62.03 1.98,62.03 FPC1.10
  Bottom 0.152: v15.7,53.65 15.7,49.53 SR2.1
SR_OUT2_3  (via drill 0.35)
  Top 0.152: v16.31,54.41 16.31,61.42 14.94,62.79 2.9,62.79 2.74,62.64 1.98,62.64 FPC1.11
  Bottom 0.152: v16.31,54.41 16.76,53.95 16.76,49.07 16.46,48.77 16.31,48.77 15.85,48.31 SR2.2
SR_OUT2_4  (via drill 0.35)
  Top 0.152: v14.63,49.38 16.92,51.66 16.92,61.27 15.09,63.09 1.98,63.09 FPC1.12
  Bottom 0.152: v14.63,49.38 14.63,48.01 15.7,46.94 SR2.3
SR_OUT2_5  (via drill 0.35)
  Top 0.152: v17.98,56.54 17.98,62.64 15.54,65.08 4.12,65.08 2.59,63.55 1.98,63.55 FPC1.13
  Bottom 0.152: v17.98,56.54 17.98,55.93 17.07,55.02 17.07,46.94 15.85,45.72 SR2.4
SR_OUT2_6  (via drill 0.35)
  Top 0.152: v19.96,56.24 18.29,57.91 18.29,62.79 15.7,65.38 3.96,65.38 2.74,64.16 1.98,64.16 FPC1.14
  Bottom 0.152: v19.96,56.24 20.57,55.63 20.57,53.65 20.42,53.49 19.36,53.49 18.29,52.43 18.29,46.79 16.46,44.96 16.31,44.96 15.85,44.5 SR2.5
SR_OUT2_7  (via drill 0.35)
  Top 0.152: v21.18,57.91 18.59,60.5 18.59,62.94 15.85,65.68 3.66,65.68 2.59,64.62 1.98,64.62 FPC1.15
  Bottom 0.152: v21.18,57.91 21.18,44.5 19.81,43.13 15.85,43.13 SR2.6
SR_OUT2_8  (via drill 0.35)
  Top 0.152: v20.73,59.28 20.73,61.27 16,65.99 3.5,65.99 2.59,65.08 1.98,65.08 FPC1.16
  Bottom 0.152: v20.73,59.28 20.57,59.13 20.57,57.61 20.88,57.3 20.88,46.79 19.96,45.87 19.36,45.87 17.22,43.74 15.09,43.74 14.94,43.59 14.94,42.67 15.7,41.91 SR2.7
SR_OUT3_1  (via drill 0.35)
  Top 0.152: v11.73,33.22 19.2,40.69 v20.27,40.69 | v21.79,60.35 21.79,60.66 16.15,66.29 3.35,66.29 2.59,65.53 1.98,65.53 FPC1.17
  Bottom 0.152: v11.73,33.22 10.21,33.22 SR3.15 | v20.27,40.69 20.27,41.15 21.49,42.37 21.49,57.3 21.79,57.61 v21.79,60.35
SR_OUT3_2  (via drill 0.35)
  Top 0.152: v15.85,39.62 15.85,44.96 19.2,48.31 20.57,48.31 v22.1,49.84 | v22.4,59.59 22.4,60.66 16.46,66.6 3.2,66.6 2.74,66.14 1.98,66.14 FPC1.18
  Bottom 0.152: v15.85,39.62 15.85,34.59 SR3.1 | v22.1,49.84 22.1,59.28 v22.4,59.59
SR_OUT3_3  (via drill 0.35)
  Top 0.152: v14.94,39.62 14.94,48.16 v17.68,50.9 | v19.96,57.15 21.34,57.15 23.77,59.59 23.77,60.81 17.68,66.9 2.9,66.9 2.59,66.6 1.98,66.6 FPC1.19
  Bottom 0.152: v14.94,39.62 14.94,33.98 15.7,33.22 SR3.2 | v17.68,50.9 17.68,54.86 v19.96,57.15
SR_OUT3_4  (via drill 0.35)
  Top 0.152: v26.06,58.37 26.06,59.44 18.29,67.21 2.13,67.21 1.98,67.06 FPC1.20
  Bottom 0.152: v26.06,58.37 26.06,39.32 19.81,33.07 19.2,33.07 18.14,32 15.85,32 SR3.3
SR_OUT3_5  (via drill 0.35)
  Top 0.152: v12.34,28.19 8.08,28.19 7.92,28.04 7.32,28.04 FPC2.1
  Bottom 0.152: v12.34,28.19 12.34,28.65 14.33,30.63 15.7,30.63 SR3.4
SR_OUT3_6  (via drill 0.35)
  Top 0.152: v13.87,29.26 12.5,29.26 11.89,28.65 7.32,28.65 FPC2.2
  Bottom 0.152: v13.87,29.26 15.7,29.26 SR3.5
SR_OUT3_7  (via drill 0.35)
  Top 0.152: v14.33,27.58 11.73,24.99 8.69,24.99 6.25,27.43 6.25,28.8 6.4,28.96 7.16,28.96 FPC2.3
  Bottom 0.152: v14.33,27.58 14.78,28.04 15.7,28.04 SR3.6
SR_OUT3_8  (via drill 0.35)
  Top 0.152: v11.73,29.41 8.08,29.41 7.92,29.57 7.32,29.57 FPC2.4
  Bottom 0.152: v11.73,29.41 11.73,27.89 12.65,26.98 15.7,26.98 SR3.7
SR_OUT4_1  (via drill 0.35)
  Top 0.152: v9.75,21.18 5.33,25.6 5.33,28.8 6.55,30.02 7.16,30.02 FPC2.5
  Bottom 0.152: v9.75,21.18 11.12,19.81 11.12,19.05 10.97,18.9 10.82,18.9 10.21,18.29 SR4.15
SR_OUT4_2  (via drill 0.35)
  Top 0.152: v14.63,19.51 12.34,19.51 v5.94,25.91 | v5.94,30.33 6.4,30.33 6.55,30.48 7.16,30.48 FPC2.6
  Bottom 0.152: v14.63,19.51 15.7,19.51 SR4.1 | v5.94,30.33 v5.94,25.91
SR_OUT4_3  (via drill 0.35)
  Top 0.152: v17.07,18.14 15.54,18.14 14.94,17.53 11.58,17.53 v5.33,23.77 | v5.33,31.09 7.16,31.09 FPC2.7
  Bottom 0.152: v17.07,18.14 15.85,18.14 SR4.2 | v5.33,31.09 v5.33,23.77
SR_OUT4_4  (via drill 0.35)
  Top 0.152: v8.53,30.94 7.92,31.55 7.32,31.55 FPC2.8
  Bottom 0.152: v8.53,30.94 8.23,30.63 8.23,10.82 9.45,9.6 16.15,9.6 17.53,10.97 17.53,15.24 16.46,16.31 16.31,16.31 15.85,16.76 SR4.3
SR_OUT4_5  (via drill 0.35)
  Top 0.152: v16.92,13.72 15.7,13.72 13.26,11.28 10.52,11.28 v4.72,17.07 | v5.33,32 7.16,32 FPC2.9
  Bottom 0.152: v16.92,13.72 16.92,14.48 15.85,15.54 SR4.4 | v4.72,17.07 4.72,31.39 v5.33,32
SR_OUT4_6  (via drill 0.35)
  Top 0.152: v14.33,14.33 13.87,14.33 12.04,12.5 11.12,12.5 v6.55,17.07 | v5.94,32.77 6.4,32.77 6.55,32.61 7.16,32.61 FPC2.10
  Bottom 0.152: v14.33,14.33 15.7,14.33 SR4.5 | v6.55,17.07 6.55,32.16 v5.94,32.77
SR_OUT4_7  (via drill 0.35)
  Top 0.152: v14.63,18.14 22.4,25.91 22.4,36.27 20.73,37.95 17.37,37.95 12.04,32.61 8.38,32.61 7.92,33.07 7.32,33.07 FPC2.11
  Bottom 0.152: v14.63,18.14 13.72,17.22 13.72,14.02 14.63,13.11 15.7,13.11 SR4.6
SR_OUT4_8  (via drill 0.35)
  Top 0.152: v12.95,11.89 10.82,11.89 4.42,18.29 4.42,38.71 5.49,39.78 7.92,39.78 8.84,38.86 8.84,34.44 7.92,33.53 7.32,33.53 FPC2.12
  Bottom 0.152: v12.95,11.89 15.7,11.89 SR4.7
SR_OUT5_1  (via drill 0.35)
  Top 0.152: v31.7,39.17 v41.3,48.77 | v21.79,29.87 21.79,25.76 14.94,18.9 11.12,18.9 4.72,25.3 4.72,32.61 6.1,33.98 7.16,33.98 FPC2.13
  Bottom 0.152: v41.3,48.77 41.3,56.08 42.67,57.45 45.41,57.45 45.72,57.76 45.72,60.96 45.41,61.27 44.2,61.27 42.37,63.09 39.32,63.09 SR5.15 | v31.7,39.17 30.48,37.95 29.87,37.95 v21.79,29.87
SR_OUT5_2  (via drill 0.35)
  Top 0.152: v24.38,63.86 v43.74,63.86 | v14.63,61.27 14.63,58.83 15.09,58.37 15.09,56.39 v7.62,48.92 | v7.62,39.17 8.53,38.25 8.53,35.2 7.92,34.59 7.32,34.59 FPC2.14
  Bottom 0.152: v43.74,63.86 44.2,64.31 44.65,64.31 SR5.1 | v24.38,63.86 23.32,62.79 17.98,62.79 16.46,61.27 v14.63,61.27 | v7.62,39.17 v7.62,48.92
SR_OUT5_3  (via drill 0.35)
  Top 0.152: v3.2,41.91 4.88,40.23 v5.03,40.23 | v5.49,38.86 5.49,36.88 5.33,36.73 5.33,35.2 5.64,34.9 6.4,34.9 6.55,35.05 7.16,35.05 FPC2.15
  Bottom 0.152: v3.2,41.91 3.2,42.06 2.29,42.98 2.13,42.98 1.83,43.28 1.83,57.91 9.6,65.68 44.81,65.68 45.72,64.77 45.72,64.01 45.57,63.86 45.41,63.86 44.81,63.25 SR5.2 | v5.03,40.23 5.03,39.32 v5.49,38.86
SR_OUT5_4  (via drill 0.35)
  Top 0.152: v4.42,41.6 v2.44,43.59 | v7.62,38.25 7.92,37.95 8.08,37.95 8.23,37.8 8.23,35.81 8.08,35.66 7.32,35.66 FPC2.16
  Bottom 0.152: v2.44,43.59 2.44,58.06 9.75,65.38 42.06,65.38 42.67,64.77 42.67,64.01 44.65,62.03 SR5.3 | v4.42,41.6 4.42,38.86 5.79,37.49 6.86,37.49 v7.62,38.25
SR_OUT5_5  (via drill 0.35)
  Top 0.152: v17.37,30.63 16.15,30.63 12.8,27.28 v7.32,27.28 | v5.94,35.51 6.4,35.97 7.16,35.97 FPC2.17
  Bottom 0.152: v17.37,30.63 19.96,30.63 26.36,37.03 26.36,53.19 34.44,61.27 39.93,61.27 40.08,61.11 40.08,58.98 39.93,58.83 38.56,58.83 38.25,58.52 38.25,57.76 38.56,57.45 39.93,57.45 40.08,57.61 40.08,57.76 42.82,60.5 44.65,60.5 SR5.4 | v7.32,27.28 7.32,34.14 v5.94,35.51
SR_OUT5_6  (via drill 0.35)
  Top 0.152: v40.69,52.88 30.94,52.88 30.63,53.19 29.87,53.19 24.38,47.7 v24.38,39.47 | v17.98,34.44 17.98,30.33 12.34,24.69 8.08,24.69 v7.62,25.15 | v5.94,36.42 6.4,36.42 6.55,36.58 7.16,36.58 FPC2.18
  Bottom 0.152: v40.69,52.88 40.69,57.91 42.06,59.28 44.65,59.28 SR5.5 | v24.38,39.47 20.27,35.36 18.9,35.36 v17.98,34.44 | v7.62,25.15 7.62,26.67 7.92,26.98 7.92,28.35 7.62,28.65 7.62,34.75 v5.94,36.42
SR_OUT5_7  (via drill 0.35)
  Top 0.152: v41.91,58.22 28.19,58.22 v23.01,63.4 | v11.28,60.05 v12.8,61.57 | v6.1,38.1 6.1,37.49 6.55,37.03 7.16,37.03 FPC2.19
  Bottom 0.152: v41.91,58.22 44.65,58.22 SR5.6 | v23.01,63.4 17.37,63.4 16.46,62.48 13.72,62.48 v12.8,61.57 | v11.28,60.05 9.3,60.05 6.1,56.84 v6.1,38.1
SR_OUT5_8  (via drill 0.35)
  Top 0.152: v42.98,55.93 42.37,55.32 31.09,55.32 30.63,55.78 22.71,55.78 20.12,53.19 19.05,53.19 15.24,49.38 15.24,49.07 7.32,41.15 v7.01,41.15 | v6.71,38.86 6.71,38.1 7.16,37.64 FPC2.20
  Bottom 0.152: v42.98,55.93 43.74,56.69 44.65,56.69 SR5.7 | v7.01,41.15 7.01,39.17 v6.71,38.86
SR_OUT6_1  (via drill 0.35)
  Top 0.152: v42.52,48.16 45.41,45.26 45.41,39.78 v53.49,31.7 | v57.61,27.58 57.61,21.79 58.06,21.34 58.06,11.73 49.68,3.35 23.32,3.35 FPC3.1
  Bottom 0.152: v42.52,48.16 39.32,48.16 SR6.15 | v57.61,27.58 v53.49,31.7
SR_OUT6_2  (via drill 0.35)
  Top 0.152: v43.59,46.18 43.59,43.28 45.11,41.76 45.11,39.17 v52.58,31.7 | v52.58,24.99 52.58,16.31 51.21,14.94 43.89,14.94 41.3,12.34 34.44,12.34 25.91,3.81 23.32,3.81 FPC3.2
  Bottom 0.152: v43.59,46.18 43.59,48.31 44.65,49.38 SR6.1 | v52.58,24.99 v52.58,31.7
SR_OUT6_3  (via drill 0.35)
  Top 0.152: v48.92,45.26 v46.02,48.16 | v24.54,4.88 23.93,4.27 23.32,4.27 FPC3.3
  Bottom 0.152: v46.02,48.16 44.81,48.16 SR6.2 | v48.92,45.26 49.53,45.26 58.22,36.58 58.22,11.43 51.66,4.88 v24.54,4.88
SR_OUT6_4  (via drill 0.35)
  Top 0.152: v42.52,44.96 41,44.96 v31.39,35.36 | v24.23,29.87 24.23,24.38 17.37,17.53 15.39,17.53 14.33,16.46 12.8,16.46 10.97,14.63 10.97,13.11 11.28,12.8 11.89,12.8 14.02,14.94 16.61,14.94 20.12,11.43 20.12,7.16 22.55,4.72 23.16,4.72 FPC3.4
  Bottom 0.152: v42.52,44.96 45.41,44.96 45.72,45.26 45.72,46.02 45.57,46.18 45.41,46.18 44.81,46.79 SR6.3 | v31.39,35.36 29.72,35.36 v24.23,29.87
SR_OUT6_5  (via drill 0.35)
  Top 0.152: v35.66,40.54 v40.69,45.57 | v20.42,12.8 20.42,7.32 22.4,5.33 23.16,5.33 FPC3.5
  Bottom 0.152: v40.69,45.57 44.65,45.57 SR6.4 | v35.66,40.54 29.87,40.54 26.67,37.34 26.67,36.88 20.12,30.33 19.05,30.33 18.29,29.57 18.29,25.15 20.42,23.01 v20.42,12.8
SR_OUT6_6  (via drill 0.35)
  Top 0.152: v32,34.59 v41.76,44.35 | v21.03,14.94 21.03,7.32 22.55,5.79 23.16,5.79 FPC3.6
  Bottom 0.152: v41.76,44.35 44.65,44.35 SR6.5 | v32,34.59 32,32 31.7,31.7 31.7,26.52 23.62,18.44 22.86,18.44 21.03,16.61 v21.03,14.94
SR_OUT6_7  (via drill 0.35)
  Top 0.152: v43.59,42.37 43.59,42.06 37.64,36.12 v36.12,36.12 | v21.64,14.17 21.64,13.72 21.34,13.41 21.34,7.47 22.55,6.25 23.16,6.25 FPC3.7
  Bottom 0.152: v43.59,42.37 44.2,42.98 44.65,42.98 SR6.6 | v36.12,36.12 32.31,32.31 32.31,31.85 32,31.55 32,26.36 23.77,18.14 23.01,18.14 21.64,16.76 v21.64,14.17
SR_OUT6_8  (via drill 0.35)
  Top 0.152: v42.37,41.76 40.08,41.76 v31.39,33.07 | v24.69,22.71 24.69,16.31 21.64,13.26 21.64,7.62 22.4,6.86 23.16,6.86 FPC3.8
  Bottom 0.152: v42.37,41.76 44.65,41.76 SR6.7 | v31.39,33.07 31.39,28.8 30.33,27.74 29.72,27.74 v24.69,22.71
SR_OUT7_1  (via drill 0.35)
  Top 0.152: v35.36,31.24 35.36,30.94 35.05,30.63 35.05,23.16 33.83,21.95 v33.83,16.61 | v24.54,7.32 23.32,7.32 FPC3.9
  Bottom 0.152: v35.36,31.24 37.19,33.07 39.17,33.07 SR7.15 | v24.54,7.32 v33.83,16.61
SR_OUT7_2  (via drill 0.35)
  Top 0.152: v45.87,30.02 45.87,27.89 45.26,27.28 45.26,24.99 44.96,24.69 41,24.69 38.71,26.98 37.49,26.98 36.88,26.36 36.88,24.54 35.05,22.71 35.05,19.96 36.58,18.44 36.58,17.68 v35.66,16.76 | v28.19,9.3 28.19,7.62 27.43,6.86 25.91,6.86 24.84,7.92 24.08,7.92 23.93,7.77 23.32,7.77 FPC3.10
  Bottom 0.152: v45.87,30.02 45.87,33.38 SR7.1 | v28.19,9.3 v35.66,16.76
SR_OUT7_3  (via drill 0.35)
  Top 0.152: v43.43,35.36 42.98,34.9 42.98,33.07 42.82,32.92 37.49,32.92 36.88,33.53 36.88,34.59 36.27,35.2 v36.12,35.2 | v25.76,18.44 25.76,16.92 21.95,13.11 21.95,8.84 22.55,8.23 23.16,8.23 FPC3.11
  Bottom 0.152: v43.43,35.36 43.43,34.44 44.65,33.22 SR7.2 | v36.12,35.2 32.31,31.39 32.31,24.99 v25.76,18.44
SR_OUT7_4  (via drill 0.35)
  Top 0.152: v40.39,31.09 36.88,31.09 v34.9,33.07 | v24.54,8.69 23.32,8.69 FPC3.12
  Bottom 0.152: v40.39,31.09 40.54,30.94 43.74,30.94 44.65,31.85 SR7.3 | v34.9,33.07 34.44,33.07 32.61,31.24 32.61,24.38 26.06,17.83 23.16,17.83 22.25,16.92 22.25,10.97 v24.54,8.69
SR_OUT7_5  (via drill 0.35)
  Top 0.152: v48.01,25.45 48.01,24.99 45.87,22.86 v45.87,21.03 | v45.87,17.53 43.74,15.39 43.74,15.24 41.15,12.65 34.29,12.65 31.55,9.91 27.89,9.91 27.58,9.6 27.58,7.47 27.28,7.16 26.67,7.16 25.15,8.69 25.15,8.99 24.84,9.3 23.32,9.3 FPC3.13
  Bottom 0.152: v48.01,25.45 46.02,27.43 44.2,27.43 43.89,27.74 43.89,29.87 44.65,30.63 SR7.4 | v45.87,17.53 v45.87,21.03
SR_OUT7_6  (via drill 0.35)
  Top 0.152: v57.45,21.03 57.45,13.72 55.78,12.04 v53.34,12.04 | v26.98,7.77 24.99,9.75 23.32,9.75 FPC3.14
  Bottom 0.152: v57.45,21.03 55.63,22.86 52.12,22.86 45.72,29.26 44.81,29.26 SR7.5 | v53.34,12.04 49.07,7.77 v26.98,7.77
SR_OUT7_7  (via drill 0.35)
  Top 0.152: v53.49,22.25 53.49,21.79 53.19,21.49 53.19,14.48 50.75,12.04 35.05,12.04 v31.7,8.69 | v26.98,8.69 26.52,8.69 24.99,10.21 23.32,10.21 FPC3.15
  Bottom 0.152: v53.49,22.25 52.27,22.25 46.48,28.04 44.81,28.04 SR7.6 | v26.98,8.69 v31.7,8.69
SR_OUT7_8  (via drill 0.35)
  Top 0.152: v47.4,21.95 47.4,20.42 43.13,16.15 43.13,15.54 42.67,15.09 36.27,15.09 32,10.82 23.32,10.82 FPC3.16
  Bottom 0.152: v47.4,21.95 47.4,25.3 45.87,26.82 SR7.7
SR_OUT8_1  (via drill 0.35)
  Top 0.152: v35.97,18.14 35.2,18.9 v34.44,18.9 | v24.54,11.73 24.08,11.28 23.32,11.28 FPC3.17
  Bottom 0.152: v35.97,18.14 39.17,18.14 SR8.15 | v34.44,18.9 31.55,18.9 24.54,11.89 v24.54,11.73
SR_OUT8_2  (via drill 0.35)
  Top 0.152: v41.6,19.51 38.41,19.51 v37.95,19.96 | v24.84,14.33 23.62,14.33 22.25,12.95 22.25,12.04 22.55,11.73 23.16,11.73 FPC3.18
  Bottom 0.152: v41.6,19.51 44.65,19.51 SR8.1 | v37.95,19.96 30.48,19.96 v24.84,14.33
SR_OUT8_3  (via drill 0.35)
  Top 0.152: v42.98,18.14 38.56,18.14 v37.95,17.53 | v25.91,12.34 23.32,12.34 FPC3.19
  Bottom 0.152: v42.98,18.14 44.65,18.14 SR8.2 | v37.95,17.53 31.09,17.53 v25.91,12.34
SR_OUT8_4  (via drill 0.35)
  Top 0.152: v24.08,13.56 23.32,12.8 FPC3.20
  Bottom 0.152: v24.08,13.56 24.08,14.48 37.03,27.43 39.93,27.43 40.39,26.98 40.39,19.81 43.28,16.92 44.65,16.92 SR8.3
SR_OUT8_5  (via drill 0.35)
  Top 0.152: v42.22,16 42.22,16.46 46.48,20.73 46.48,23.01 v49.68,26.21 | v49.68,42.22 50.75,43.28 FPC4.1
  Bottom 0.152: v42.22,16 42.52,15.7 44.65,15.7 SR8.4 | v49.68,42.22 v49.68,26.21
SR_OUT8_6  (via drill 0.35)
  Top 0.152: v48.62,17.22 50.9,17.22 52.12,18.44 52.12,24.54 51.97,24.69 v51.97,26.21 | v51.36,42.52 51.36,42.82 51.66,43.13 51.66,43.59 51.51,43.74 50.9,43.74 FPC4.2
  Bottom 0.152: v48.62,17.22 48.01,17.22 45.26,14.48 44.81,14.48 SR8.5 | v51.97,26.21 51.97,41.91 v51.36,42.52
SR_OUT8_7  (via drill 0.35)
  Top 0.152: v47.85,16.15 47.85,18.59 49.23,19.96 51.05,19.96 51.82,20.73 51.82,24.38 v50.9,25.3 | v49.53,43.43 49.53,43.89 49.99,44.35 FPC4.3
  Bottom 0.152: v47.85,16.15 SR8.6 | v50.9,25.3 50.9,42.06 v49.53,43.43
SR_OUT8_8  (via drill 0.35)
  Top 0.152: v56.84,20.27 56.84,33.07 56.08,33.83 54.1,33.83 51.97,35.97 51.97,44.35 51.51,44.81 50.9,44.81 FPC4.4
  Bottom 0.152: v56.84,20.27 56.84,18.14 56.24,17.53 54.25,17.53 51.66,14.94 49.23,14.94 46.18,11.89 44.81,11.89 SR8.7
VCC  (via drill 0.35)
  Top 0.152: 47.09,61.57 43.59,58.06 43.59,55.63 42.67,54.71 30.33,54.71 U1.24 | 47.09,61.57 48.92,63.4 56.08,63.4 57.15,62.33 57.15,42.22 55.17,40.23 55.17,34.44 U2.14 | v42.06,64.47 44.2,64.47 47.09,61.57 | JP2.1 54.86,10.97 50.14,10.97 JP4.1 | v35.05,18.14 35.05,16 | 35.05,16 v35.05,15.24 | v33.53,30.79 33.53,17.22 33.22,16.92 33.22,16.31 33.53,16 35.05,16
  Bottom 0.152: SR1.16 10.21,64.47 13.87,64.47 14.48,65.08 38.56,65.08 39.17,64.47 SR5.16 39.32,64.47 v42.06,64.47 | 38.25,55.17 39.17,54.25 39.17,49.53 SR6.16 39.17,49.38 38.71,49.38 37.95,48.62 37.95,45.57 38.56,44.96 39.93,44.96 40.08,44.81 40.08,42.67 39.32,41.91 SR6.10 39.17,41.76 38.25,40.84 38.25,40.23 39.17,39.32 39.17,34.59 SR7.16 39.32,34.44 40.08,33.68 40.08,32.77 39.78,32.46 37.49,32.46 35.66,30.63 33.68,30.63 v33.53,30.79 | 38.25,55.17 38.25,55.93 39.17,56.84 SR5.10 | 38.25,55.17 30.79,55.17 30.33,54.71 U1.24 | SR3.16 10.06,34.59 10.06,39.47 9.3,40.23 9.3,41 10.06,41.76 SR2.10 | SR2.16 10.06,49.53 10.06,54.41 9.3,55.17 9.3,55.93 10.06,56.69 SR1.10 10.21,56.84 12.34,54.71 12.34,43.89 10.97,42.52 10.82,42.52 10.21,41.91 SR2.10 | 38.56,11.73 39.17,11.73 SR8.10 | 38.56,11.73 37.95,11.12 37.95,10.06 38.41,9.6 48.77,9.6 49.99,10.82 JP4.1 | SR7.10 39.17,26.82 38.25,25.91 38.25,25.15 39.17,24.23 39.17,19.51 SR8.16 39.17,19.36 35.05,19.36 | 16.76,24.69 13.72,21.64 13.72,18.59 13.11,17.98 13.11,13.56 11.43,11.89 10.21,11.89 SR4.10 | 16.76,24.69 16.76,25.91 16.46,26.21 | 16.46,26.21 10.82,26.21 10.21,26.82 SR3.10 10.06,26.82 9.14,25.91 9.14,20.88 10.06,19.96 10.06,19.51 SR4.16 | 35.05,19.36 34.9,19.36 34.75,19.51 31.39,19.51 23.93,12.04 23.93,10.21 25.15,8.99 25.15,8.38 24.84,8.08 24.23,8.08 18.75,13.56 18.75,24.23 18.29,24.69 16.76,24.69 | v35.05,15.24 38.56,11.73 | 35.05,19.36 v35.05,18.14 | 16.46,26.21 16.76,26.52 16.76,30.94 16.46,31.24 15.09,31.24 14.63,31.7 14.63,37.49 10.97,41.15 10.82,41.15 10.21,41.76 SR2.10

### Text on the board
tNames: Decoder_Input | 1 | 1 | 2 | 2 | FPC1 | FPC4 | FPC2 | Latch | Clock | DataIN | DataOUT | GND | VCC | FPC3 | Hsia & Warren / 2023/6/6 SR Control Board